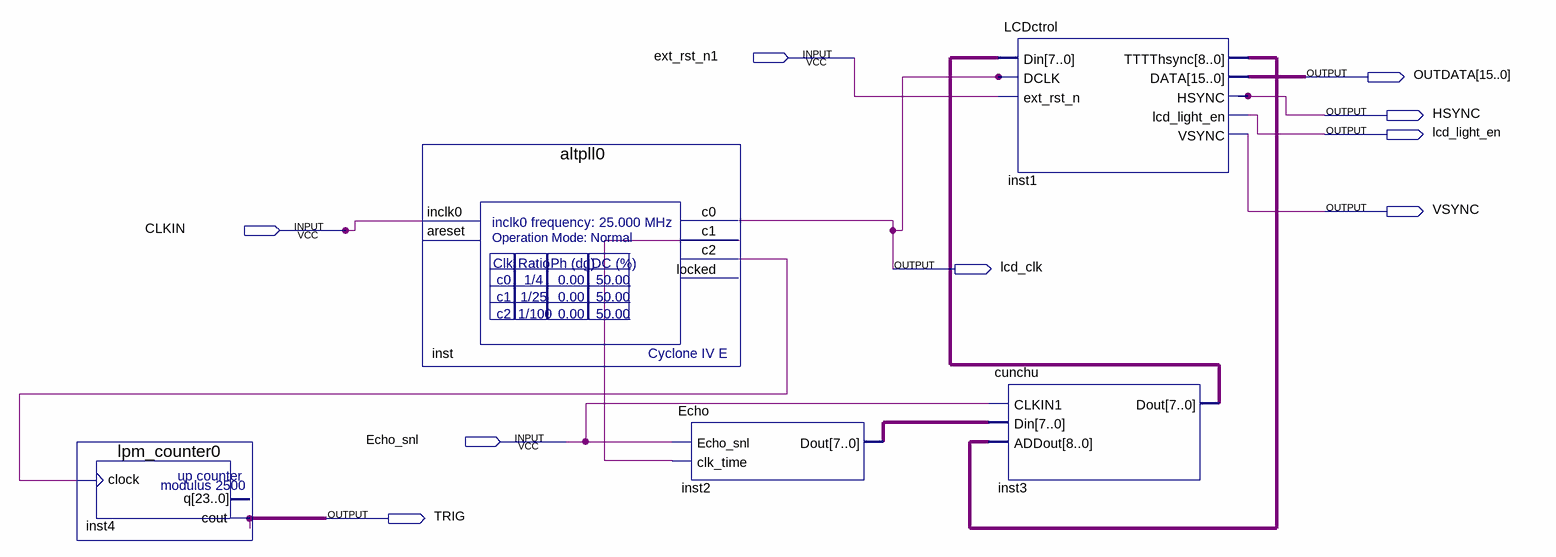
[diagram p0: schematic sheet]
// Quartus schematic LCD.bdf as structural Verilog: 5 symbols, 9 pins
module LCD (
  input  ext_rst_n1,
  input  CLKIN,
  input  Echo_snl,
  output [15:0] OUTDATA,
  output HSYNC,
  output lcd_light_en,
  output VSYNC,
  output lcd_clk,
  output TRIG
);

  wire inst_c1, inst_c2;
  wire [7:0] inst2_dout, inst3_dout;
  wire [8:0] inst1_tttthsync;

  lpm_counter0 inst4 (.clock(inst_c2), .cout(TRIG));  // open: q
  altpll0 inst (.inclk0(CLKIN), .c0(lcd_clk), .c1(inst_c1), .c2(inst_c2));  // open: areset, locked
  Echo inst2 (.Echo_snl(Echo_snl), .clk_time(inst_c1), .Dout(inst2_dout));
  LCDctrol inst1 (
    .Din(inst3_dout), .DCLK(lcd_clk), .ext_rst_n(ext_rst_n1), .TTTThsync(inst1_tttthsync), .DATA(OUTDATA),
    .HSYNC(HSYNC), .lcd_light_en(lcd_light_en), .VSYNC(VSYNC));
  cunchu inst3 (.CLKIN1(Echo_snl), .Din(inst2_dout), .ADDout(inst1_tttthsync), .Dout(inst3_dout));
endmodule
